# Altium schematic sheet DigitalInputs.SchDoc
size A3; SheetNumber: 4; SheetTotal: 11
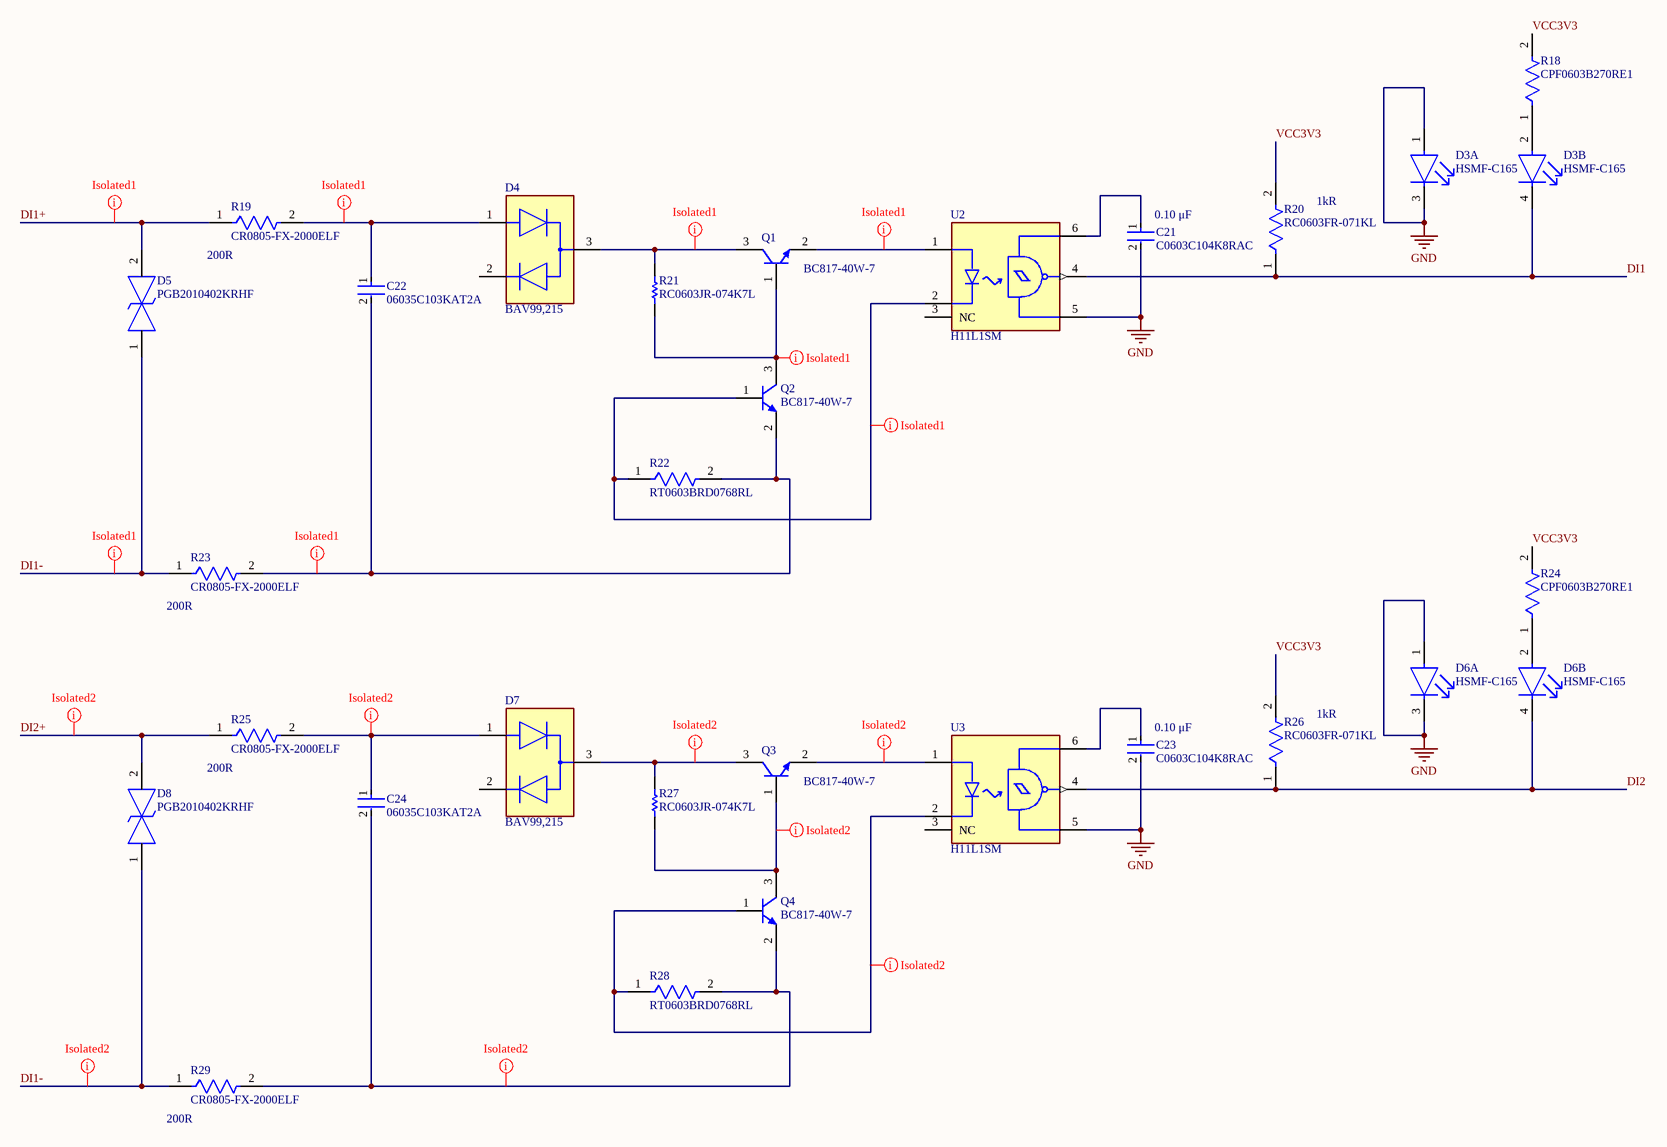
[diagram p0: DigitalInputs.SchDoc]

## Parts
C21  C0603C104K8RAC  Capacitance: 0.10 μF  [FP-C0603C-CF-MFG]
C22  06035C103KAT2A  [FP-0603-L_1_6_0_15-W_0_81-MFG]
C23  C0603C104K8RAC  Capacitance: 0.10 μF  [FP-C0603C-CF-MFG]
C24  06035C103KAT2A  [FP-0603-L_1_6_0_15-W_0_81-MFG]
D3  HSMF-C165  [FP-HSMF-C165-MFG]  (parts A,B of 2)
D4  BAV99,215  [FP-SOT23-MFG]
D5  PGB2010402KRHF  [DIONC1005X38N]
D6  HSMF-C165  [FP-HSMF-C165-MFG]  (parts A,B of 2)
D7  BAV99,215  [FP-SOT23-MFG]
D8  PGB2010402KRHF  [DIONC1005X38N]
Q1  BC817-40W-7  [DIOD-SOT323-3_V]
Q2  BC817-40W-7  [DIOD-SOT323-3_V]
Q3  BC817-40W-7  [DIOD-SOT323-3_V]
Q4  BC817-40W-7  [DIOD-SOT323-3_V]
R18  CPF0603B270RE1  [FP-CPF0603-MFG]
R19  CR0805-FX-2000ELF  Resistance: 200R  [FP-CR0805-IPC_B]
R20  RC0603FR-071KL  Resistance: 1kR  [FP-RC0603-0_55-IPC_C]
R21  RC0603JR-074K7L  [RESC1608X55X25ML10T15]
R22  RT0603BRD0768RL  [FP-RT0603-MFG]
R23  CR0805-FX-2000ELF  Resistance: 200R  [FP-CR0805-IPC_B]
R24  CPF0603B270RE1  [FP-CPF0603-MFG]
R25  CR0805-FX-2000ELF  Resistance: 200R  [FP-CR0805-IPC_B]
R26  RC0603FR-071KL  Resistance: 1kR  [FP-RC0603-0_55-IPC_C]
R27  RC0603JR-074K7L  [RESC1608X55X25ML10T15]
R28  RT0603BRD0768RL  [FP-RT0603-MFG]
R29  CR0805-FX-2000ELF  Resistance: 200R  [FP-CR0805-IPC_B]
U2  H11L1SM  [FP-646BY-MFG]
U3  H11L1SM  [FP-646BY-MFG]

## Nets
GND: C21.2 C23.2 D3.1(GREEN_A) D3.3(GREEN_C) D6.1(GREEN_A) D6.3(GREEN_C) U2.5(GND) U3.5(GND)
DI1: D3.4(RED_C) R20.1 U2.4(VO)
DI1+: D5.2 R19.1
DI1-: D5.1 D8.1 R23.1 R29.1
DI2: D6.4(RED_C) R26.1 U3.4(VO)
DI2+: D8.2 R25.1
VCC3V3: R18.2 R20.2 R24.2 R26.2
NetC21_1: C21.1 U2.6(VCC)
NetC22_1: C22.1 D4.1 R19.2
NetC22_2: C22.2 Q2.2(E) R22.2 R23.2
NetC23_1: C23.1 U3.6(VCC)
NetC24_1: C24.1 D7.1 R25.2
NetC24_2: C24.2 Q4.2(E) R28.2 R29.2
NetD3_2: D3.2(RED_A) R18.1
NetD4_3: D4.3 Q1.3(C) R21.2
NetD6_2: D6.2(RED_A) R24.1
NetD7_3: D7.3 Q3.3(C) R27.2
NetQ1_1: Q1.1(B) Q2.3(C) R21.1
NetQ1_2: Q1.2(E) U2.1(A)
NetQ2_1: Q2.1(B) R22.1 U2.2(C)
NetQ3_1: Q3.1(B) Q4.3(C) R27.1
NetQ3_2: Q3.2(E) U3.1(A)
NetQ4_1: Q4.1(B) R28.1 U3.2(C)

Not connected (* = marked no-connect by the designer): D4 2; D7 2; U2 3(NC); U3 3(NC)

## Layout directives
net class Isolated1: DI1+, DI1-, NetC22_1, NetC22_2, NetD4_3, NetQ1_1, NetQ1_2, NetQ2_1
net class Isolated2: DI1-, DI2+, NetC24_1, NetC24_2, NetD7_3, NetQ3_1, NetQ3_2, NetQ4_1

## Library data of the parts
C21 C23 = CMP-03020-006081-2: C0603 0.10 μF X7R 30ppm/°C 10.00% 10 V; Manufacturer: KEMET; Value: 0.10 μF; Material: Ceramic; Automotive Grade: Grade 1; Voltage Rating: 10 V; Tolerance: 0.1; Automotive: Yes; Device Class L2: Capacitors; Height: 0.87mm; Temperature Range High: +125°C; Temperature Coefficient: 30ppm/°C; Temperature Range Low: -55°C; Package: C0603C-CF; Lead Free: Yes; Octopart: https://octopart.com/c0603c104k8rac-kemet-1325403; Manufacturer Part Number: C0603C104K8RAC; Temperature: -55°C to +125°C; Mouser Description: .1UF 10V 10% 0603; RoHS: TRUE; ComponentLink2URL: https://api.kemet.com/component-edge/download/datasheet/C0603C100J5GACAUTO.pdf; ComponentLink2Description: Datasheet; Temperature Characteristic: X7R; Device Class L1: Passive Components; Category: Cap; Device Class L3: Ceramic Capacitors
C22 C24 = CMP-2006-04374-2: General Purpose Ceramic Capacitor, 0603, 10nF, 10%, X7R, 15%, 50V; Insulation Resistance: 100GR; Dissipation Factor: 2.5%; Voltage: 50V; Number of Pins: 2; Min Operating Temperature: -55°C; Mount: Surface Mount; Capacitance: 10nF; Width: 0.032inch; Height: 0.9mm; Voltage Rating: 50V; Termination: SMD/SMT; Package Quantity: 1; Dielectric: X7R; Max Operating Temperature: 125°C; Contact Plating: Tin; Length: 1.6mm; Dielectric Material: Ceramic; REACH SVHC: No SVHC; Case Code (Imperial): 0603; Depth: 0.81mm; Thickness: 0.035inch; Packaging: Tape and Reel; Tolerance: 10%; Lead Free: Lead Free; Voltage Rating (DC): 50V; Radiation Hardening: No; Case/Package: 0603; Case Code (Metric): 1608
D3 D6 = CMP-2000-06424-2: LED GREEN/RED DIFFUSED 0603 SMD; Reverse Voltage: 5V; Dominant Wavelength: 621nm; Number of Elements: 2; Shape: Rectangular; Luminous Intensity: 10mcd; Forward Current: 20mA; Lens Color: White; Illumination Color: Green; Power Dissipation: 52mW; Wavelength: 572nm; Viewing Angle: 120°; Forward Voltage: 2.2V; Max Operating Temperature: 85°C; Lens Transparency: Diffused; Width: 0.8mm; Case/Package: 0603; Packaging: Tape and Reel; Case Code (Metric): 1608; Depth: 0.8mm; REACH SVHC: No SVHC; Number of LEDs: 2; Radiation Hardening: No; Lens Style: Rectangular; Color: Green; Case Code (Imperial): 0603; Min Operating Temperature: -40°C; Power Rating: 52mW; Number of Pins: 4; Number of Terminals: 4; Package Quantity: 1; Mount: Surface Mount; Height: 0.5mm; Length: 1.6mm; Lead Free: Lead Free; Test Current: 20mA
D4 D7 = CMP-14399-000006-1: DIODE ARRAY GP 100V 215MA SOT23
D5 D8 = PGB2010402KRHF: Littelfuse PGB2 Series Metal Oxide Varistor 0.07pF, Clamping 40V 0402 (1005M) Case; Geometry.Height: 0.38mm; Mouser Part Number: 576-PGB2010402KRHF; Mouser Price/Stock: https://www.mouser.co.uk/ProductDetail/Littelfuse/PGB2010402KRHF?qs=%2FlIrRR7EiyoCDVt%2F%252Bx2RKA%3D%3D; Manufacturer_Name: LITTELFUSE; Manufacturer_Part_Number: PGB2010402KRHF; Datasheet Link: https://componentsearchengine.com/Datasheets/1/PGB2010402KRHF.pdf
Q1-Q4 = CMP-2000-05934-1: NPN Small Signal Transistor, 45 V, 500 mA, -65 to 150 degC, 3-Pin SOT323, RoHS, Tape and Reel; Manufacturer: DiodesIncorporated; Configuration: Single; Collector- Emitter Voltage VCEO Max: 45V; Emitter- Base Voltage VEBO: 5V; DC Collector/Base Gain hfe Min: 250; Collector-Emitter Saturation Voltage: 0.7V; Collector- Base Voltage VCBO: 50V; Maximum DC Collector Current: 1A; Pd - Power Dissipation: 200mW; Gain Bandwidth Product fT: 100MHz; Unit Weight: 0.000282oz; Series: BC817; Datasheet Version: Rev. 5-2, 01/2014; Datasheet URL: http://www.diodes.com/_files/datasheets/ds30575.pdf; Manufacturer URL: http://www.diodes.com/; Length: 2.2mm; Mounting Style: SMD/SMT; Maximum Operating Temperature: +150C; Package Description: 3-Pin Small Outline Transistor, Body 2 x 1.25 mm, Pitch 0.65 mm; Width: 1.35mm; RoHS: True; Minimum Operating Temperature: -65C; Brand: DiodesIncorporated; Product Category: BipolarTransistors-BJT; Height: 1mm; Factory Pack Quantity: 3000; Package / Case: SOT-23; Packaging: Reel; Transistor Polarity: NPN; Mounting Technology: SurfaceMount; Package Reference: SOT323
R18 R24 = CMP-03211-003278-1: RES SMD 270Ω 0.1% 1/16W 0603; Manufacturer: TE Connectivity; Power Rating: 0.063W; Temperature Coefficient: 25ppm/°C; Voltage Rating: 50V; Composition: Thin Film; Value: 270Ω; Lead Free: Yes; Automotive: No; Category: Res; Tolerance: 0.1%; ComponentLink2Description: Datasheet; Temperature: -55°C to +155°C; Series: CPF; Manufacturer Part Number: CPF0603B270RE1; octopart_url: https://octopart.com/cpf0603b270re1-te+connectivity-9539412; Device Class L3: Chip SMD Resistors; Temperature Range Low: -55°C; ComponentLink2URL: https://www.te.com/commerce/DocumentDelivery/DDEController?Action=showdoc&DocId=Data+Sheet%7F1773200%7FM%7Fpdf%7FEnglish%7FENG_DS_1773200_M.pdf%7F3-1676481-2; Ipc Land Pattern Name: RESC15580X45; RoHS: TRUE; packaging: 1k Reel; Package: CPF0603; Device Class L2: Resistors; Device Class L1: Passive Components; Octopart: https://octopart.com/cpf0603b270re1-te+connectivity-9539412; Temperature Range High: +155°C; Resistance: 270Ω; Height: 0.55mm
R19 R23 R25 R29 = CMP-1013-00429-2: Thick Film Chip Resistors 0805 200Ω 0.125W 1% 100ppm/°C; Power Rating: 125mW; Voltage Rating: 150V; Max Operating Temperature: 155°C; Min Operating Temperature: -55°C; Case Code (Metric): 2012; Temperature Coefficient: 100ppm/°C; Case/Package: 0805; Termination: SMD/SMT; Mount: Surface Mount; Length: 2mm; Height: 0.5mm; Thickness: 508um; Military Standard: Not; Case Code (Imperial): 0805; Tolerance: 1%; Packaging: Tape and Reel; Package Quantity: 5000; Composition: Thick Film; Contact Plating: Tin; Depth: 1.25mm; Width: 1.25mm; Radiation Hardening: No
R20 R26 = CMP-1659-00009-5: RES 1K OHM 1% 1/10W 0603; Voltage Rating: 50V; Power Rating: 100mW; Temperature Coefficient: 100ppm/°C; Military Standard: Not; REACH SVHC: No SVHC; Size Code: 0603; Features: Moisture Resistant; Number of Terminations: 2; Technology: THICK FILM; Series: RC; Case Code (Metric): 1608; Resistance Tolerance: 1%; Resistor Type: Thick Film; Termination: SMD/SMT; Contact Plating: Tin; Radiation Hardening: No; Min Operating Temperature: -55°C; Max Operating Temperature: 155°C; Packaging: Tape and Reel; Max Power Dissipation: 100mW; RoHS Compliant: Yes; Height: 0.45mm; Lead Free: Lead Free; Case/Package: 0603; Length: 1.6mm; Tolerance: 1%; Case Code (Imperial): 0603; Construction: Rectangular; Depth: 0.8mm
R21 R27 = CMP-2000-05024-1: Chip Resistor, 4.7 KOhm, +/- 5%, 100 mW, -55 to 155 degC, 0603 (1608 Metric), RoHS, Tape and Reel; Manufacturer: Yageo; Resistance: 4.7kOhms; Temperature Coefficient: 100PPM/C; Power Rating: 100mW; Voltage Rating: 50V; Operating Temperature Range: -55Cto+155C; Case Code - mm: 1608; Tolerance: 5%; Product: ThickFilmResistorsGeneralPurpose; Case Code - in: 0603; Datasheet URL: http://www.yageo.com/documents/recent/PYu-RC_Group_51_RoHS_L_04.pdf; Package Reference: 603; Datasheet Version: Rev. 4, 02/2016; Package Description: 2-Pin Surface Mount Device, Body 1.6 x 0.8 mm; Manufacturer URL: http://www.yageo.com/; Series: RC; Packaging: Reel; Termination Style: SMD/SMT
R22 R28 = CMP-2000-04491-2: RES 68.0 OHM 1/10W .1% SMD 0603; Manufacturer: Yageo; Tolerance: 0.001; Temperature Coefficient: 25 ppm/°C; Resistance: 68Ω; Voltage Rating: 75V; Power Rating: 0.1W; Value: 68Ω; Automotive: No; Device Class L3: Chip SMD Resistors; Footprint Url: http://www.yageo.com/exep/pages/download/literatures/PYu-R_Mount_10.pdf; Octopart: https://octopart.com/rt0603brd0768rl-yageo-1442936; Temperature Range High: +155°C; Package: RT0603; Temperature Range Low: -55°C; Temperature: -55°C to +155°C; ComponentLink2Description: Datasheet; Digikey Description: RES 68.0 OHM 1/10W .1% SMD 0603; Manufacturer Part Number: RT0603BRD0768RL; Series: RT; Ipc Land Pattern Name: RESC16080X45; ComponentLink2URL: http://www.yageo.com/documents/recent/PYu-RT_1-to-0.01_RoHS_L_9.pdf; Category: Res; Lead Free: Yes; RoHS: TRUE; Device Class L1: Passive Components; Mouser Description: Thin Film Resistors 1/10W 68 ohm .1% 25ppm; Device Class L2: Resistors; Composition: Thin Film; Height: 0.55mm
U2 U3 = CMP-2000-06383-2: OPTOISO 4.17KV OPN COLL 6SMD; Manufacturer: ON Semiconductor; Max Junction Temp: +125°C; Max Supply Voltage: 15V; Turn On Delay Time: 1us; Isolation Voltage: 4170Vrms; Min Supply Voltage: 3V; Forward Voltage: 1.2V; Power Dissipation: 250mW; Forward Current: 10mA; Standoff Height: 0.38mm; Turn Off Delay Time: 1.2us; Device Class L3: unset; Package: 646BY; Device Class L1: Optoelectronics; Temperature: -40°C to +85°C; Lead Free: Yes; ComponentLink2Description: Datasheet; RoHS: TRUE; Footprint Url: https://www.onsemi.com/pub/Collateral/646BY.PDF; Temperature Range High: +85°C; Octopart: https://octopart.com/h11l1sm-on+semiconductor-84328916; Device Class L2: Optocouplers; Height: 4.8mm; Category: IC; Temperature Range Low: -40°C; Reverse Voltage: 3V; ComponentLink2URL: https://www.onsemi.com/pub/Collateral/H11L3M-D.PDF; Manufacturer Part Number: H11L1SM; Automotive: No; Digikey Description: OPTOISO 4.17KV OPN COLL 6SMD